# EAGLE design Grove - Infrared Reflective Sensor (EAGLE 6.6.0)
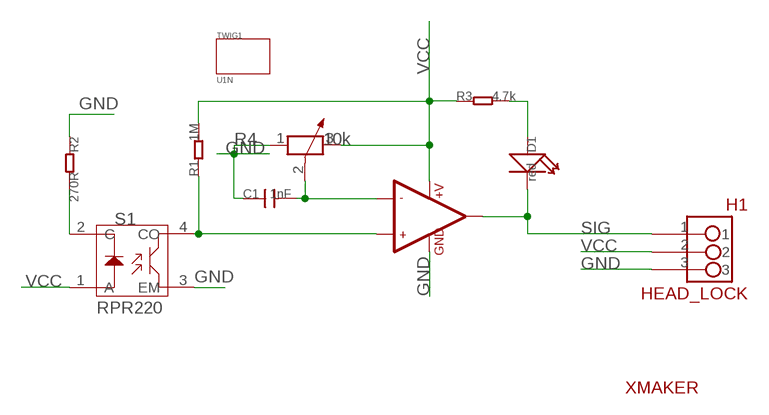
[diagram p0: schematic, sheet 1]

## Parts
C1  1nF  C-0603  [0603]
D1  red  007-LED35*40  [LED0603]
H1  HEAD_LOCK  [HEAD_LOCK]
R1  1M  005-R0603_S  [0603_S]
R2  270R  005-R0603_S  [0603_S]
R3  4.7k  005-R0603_S  [0603_S]
R4  10k  R-POTENTIOMETEREVN-D8A-A03-B**  [3P-SQUA-6.7X6.4]
S1  RPR220  REFLECTIVE-PHOTOSENSOR-RPR-220  [4P-6.4X4.9X6.5H]
TWIG1  U1N  [U1N]
U1  002-LMV358  [SO08]
U$3  XMAKERLOGO2  [XMAKERLOGO2]

## Nets
GND: C1.1 H1.3 R2.1 R4.1 S1.3(EM) U1.4(GND)
N$1: C1.2 R4.2 U1.2(-IN1)
N$2: R1.1 S1.4(CO) U1.3(+IN1)
N$5: R2.2 S1.2(C)
N$12: D1.1(+) R3.2
SIG: D1.2(-) H1.1 U1.1(OUT1)
VCC: H1.2 R1.2 R3.1 R4.3 S1.1(A) U1.8(+V)
Unconnected: U1.5(+IN2) U1.6(-IN2) U1.7(OUT2)

## Library data of the parts
C1 = Discrete:C*: Ceramic Capacitors
D1 = Discrete:007-LED*
H1 = HEAD_LOCK:HEAD_LOCK: 带锁的排座
R1-R3 = Discrete:005-R*
R4 = Discrete:R-POTENTIOMETER*: Potentiometer
S1 = Discrete:REFLECTIVE-PHOTOSENSOR-RPR-220: http://wenku.baidu.com/view/18864e7d27284b73f24250aa.html
TWIG1 = EXT_moudle:U1N
U1 = ICs:002-LMV358
U$3 = Xmaker_yuhui:XMAKERLOGO2

## Board
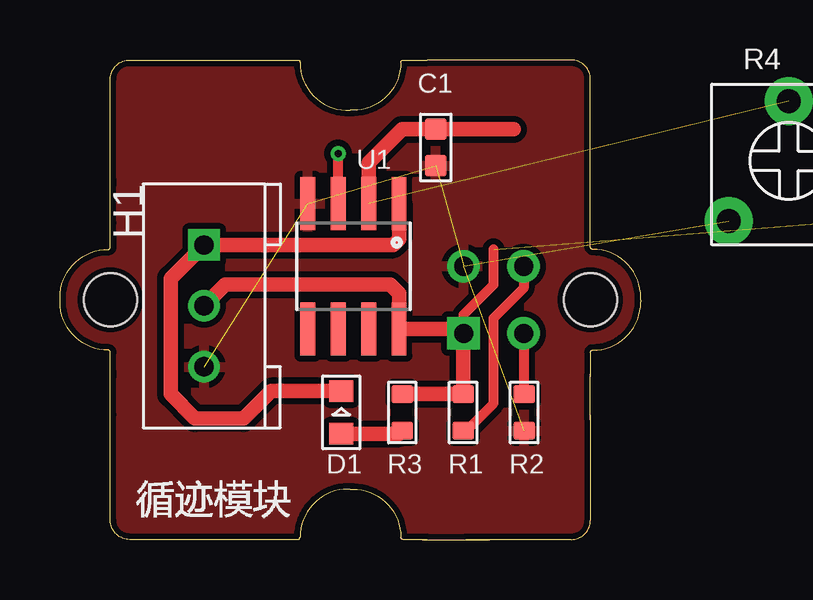
[diagram p1: board, top side]
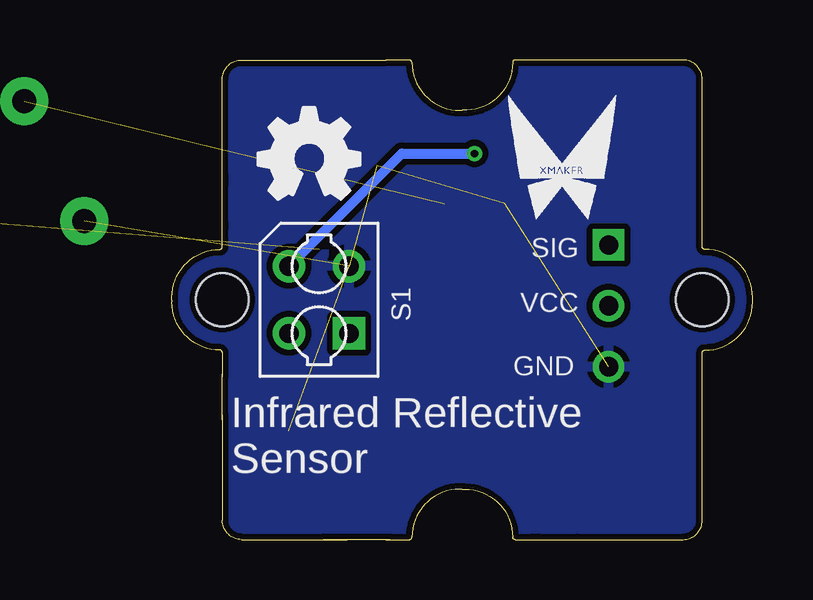
[diagram p2: board, bottom side, seen from below]

Size 24.2 x 20 mm. Coordinates in mm from the lower left corner, seen from the top.
Copper layers (1*16): Top 0.035mm / dielectric 1.5mm / Bottom 0.035mm
Design rules "default": minimum track width 6mil, minimum drill 12mil, track to track 6mil, track to pad 6mil, pad to pad 6mil, via to via 6mil, smd to smd 0mil, copper to edge 10mil, drill to drill 10mil, minimum pad ring 10mil, minimum via ring 6mil, stop-mask expansion 2mil, vias tented up to drill 100mil, thermal gap 10mil

### Footprints (pad centres in the part's own frame; a part is rotated, then mirrored left to right if it is on the bottom)
0603 = smd 0.889 x 0.889: 1 -0.762,0; 2 0.762,0
LED0603 = smd 0.889 x 1.016: 1 -0.889,0; 2 0.889,0
HEAD_LOCK = drill 0.8 square: 1 0,0 | drill 0.8: 2 2.54,0; 3 5.08,0
0603_S = smd 0.762 x 0.889: 1 -0.762,0; 2 0.762,0
3P-SQUA-6.7X6.4 = drill 1 pad 2: 1 -2.5,-2.5; 2 0,2.5; 3 2.5,-2.5
4P-6.4X4.9X6.5H = drill 0.8 pad 1.35 square: 1 -1.4,-1.25 | drill 0.8 pad 1.35: 2 -1.4,1.25; 3 1.4,-1.25; 4 1.4,1.25
U1N = hole 2.2: 0,-10; 0,10
SO08 = smd 0.61 x 2.21: 1 -1.905,-2.616; 2 -0.635,-2.616; 3 0.635,-2.616; 4 1.905,-2.616; 5 1.905,2.616; 6 0.635,2.616; 7 -0.635,2.616; 8 -1.905,2.616

### Placement (x,y rotation side)
C1  15.66,16.35 90 top
D1  11.72,5.3 90 top
H1  6,12.29 270 top
R1  16.8,5.3 90 top
R2  19.34,5.3 90 top
R3  14.26,5.3 270 top
R4  30.36,15.79 0 top  (outside the outline)
S1  18.07,10 90 bottom
TWIG1  12.1,10 90 top
U1  12.23,11.4 180 top
U$1  [OSHW_FILLX150_NOTEXT]  20.61,14.19 0 bottom
U$3  11.46,12.41 0 bottom

### Tracks (layer width: path | path; a pad name or v marks a point on that pad's centre or on a via)
GND  (5 unrouted)
  pour Top (isolate 0.254): -0.35,20.54 24.42,20.54 24.42,-0.41 -0.35,-0.41
  pour Bottom (isolate 0.254): -0.35,20.54 24.42,20.54 24.42,-0.41 -0.35,-0.41
N$1  (1 unrouted)
  Top 0.61: U1.2 12.86,15.71 14.26,17.11 C1.2 18.91,17.11
N$2  (via drill 0.3 pad 0.64)
  Top 0.406: R1.1 16.93,4.54 18.07,5.68 18.07,9.24 19.32,10.49 S1.4 | U1.3 v11.59,16.1
  Bottom 0.406: S1.4 14.62,16.1 v11.59,16.1
N$5
  Top 0.406: R2.2 19.34,8.58 S1.2
N$12
  Top 0.61: D1.1 14.13,4.41 R3.2
SIG
  Top 0.61: U1.1 14.13,12.54 13.88,12.29 H1.1 4.61,10.89 4.61,6.06 5.62,5.05 7.65,5.05 8.8,6.19 D1.2
VCC  (1 unrouted)
  Top 0.406: 18.07,12.1 18.07,10.64 16.82,9.39 S1.1
  Top 0.61: R3.1 R1.2 16.8,8.58 | 16.8,8.58 S1.1 | 16.8,8.58 16.8,8.78 U1.8 14.13,10.25 13.75,10.64 6.89,10.64 H1.2

### Text on the board
bPlace: SIG | VCC | GND | Infrared Reflective | Sensor